# EAGLE design ESP (EAGLE 9.3.0)
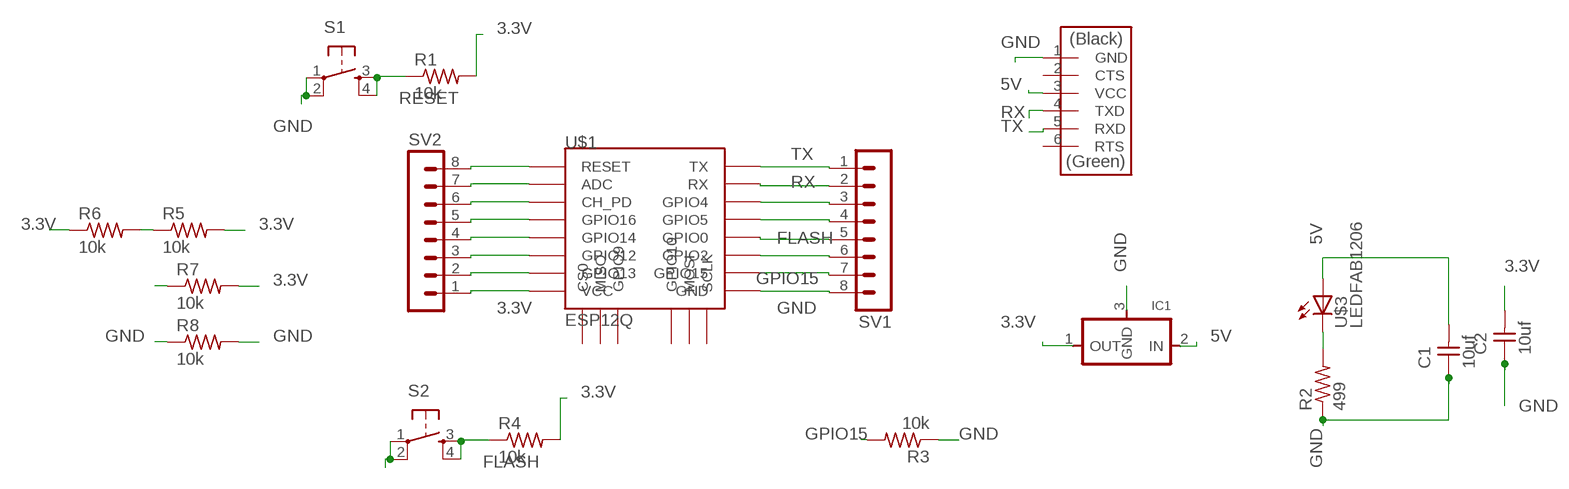
[diagram p0: schematic, sheet 1]

## Parts
C1  10uf  CAP-UNPOLARIZEDFAB  [C1206FAB]
C2  10uf  CAP-UNPOLARIZEDFAB  [C1206FAB]
IC1  REGULATORSOT23  [SOT23]
R1  10k  RES-US1206FAB  [R1206FAB]
R2  499  RES-US1206FAB  [R1206FAB]
R3  10k  RES-US1206FAB  [R1206FAB]
R4  10k  RES-US1206FAB  [R1206FAB]
R5  10k  RES-US1206FAB  [R1206FAB]
R6  10k  RES-US1206FAB  [R1206FAB]
R7  10k  RES-US1206FAB  [R1206FAB]
R8  10k  RES-US1206FAB  [R1206FAB]
S1  6MM_SWITCH6MM_SWITCH  [6MM_SWITCH]
S2  6MM_SWITCH6MM_SWITCH  [6MM_SWITCH]
SV1  MA08-1  [MA08-1]
SV2  MA08-1  [MA08-1]
U$1  ESP12Q  [ESP12Q]
U$2  FTDI-SMD-HEADER  [1X06SMD]
U$3  LEDFAB1206  [LED1206FAB]

## Nets
3.3V: C2.2 IC1.1(OUT) R1.2 R4.2 R5.1 R5.2 R6.1 R6.2 R7.1 R7.2 SV2.1 U$1.VCC
5V: C1.2 IC1.2(IN) U$2.3(VCC) U$3.1(A)
FLASH: R4.1 S2.3(S) S2.4(S1) SV1.5 U$1.GPIO0
GND: C1.1 C2.1 IC1.3(GND) R2.1 R3.1 R8.1 R8.2 S1.1(P) S1.2(P1) SV1.8 U$1.GND U$2.1(GND)
GND1: S2.1(P) S2.2(P1)
GPIO15: R3.2 SV1.7 U$1.GPIO15
N$2: SV2.2 U$1.GPIO13
N$3: SV2.3 U$1.GPIO12
N$4: SV2.4 U$1.GPIO14
N$5: SV2.5 U$1.GPIO16
N$6: SV2.6 U$1.CH_PD
N$7: SV2.7 U$1.ADC
N$9: R2.2 U$3.2(C)
N$11: SV1.3 U$1.GPIO4
N$12: SV1.4 U$1.GPIO5
N$14: SV1.6 U$1.GPIO2
RESET: R1.1 S1.3(S) S1.4(S1) SV2.8 U$1.RESET
RX: SV1.2 U$1.RX U$2.4(TXD)
TX: SV1.1 U$1.TX U$2.5(RXD)
Unconnected: U$1.CS0 U$1.GPIO9 U$1.GPIO10 U$1.MISO U$1.MOSI U$1.SCLK U$2.2(CTS) U$2.6(RTS)

## Library data of the parts
C1 C2 = fab:CAP-UNPOLARIZED
IC1 = fab:REGULATOR
R1-R8 = fab:RES-US: Resistor (US Symbol) Variants with postfix FAB are widened to allow the routing of internal traces
S1 S2 = fab:6MM_SWITCH: OMRON SWITCH
SV1 SV2 = con-lstb:MA08-1: PIN HEADER; OC_FARNELL: unknown; OC_NEWARK: unknown
U$1 = esp826612q:ESP12Q: ESP8266 Wifi module 12-Q
U$2 = fab:FTDI-SMD-HEADER
U$3 = fab:LED: LED

## Board
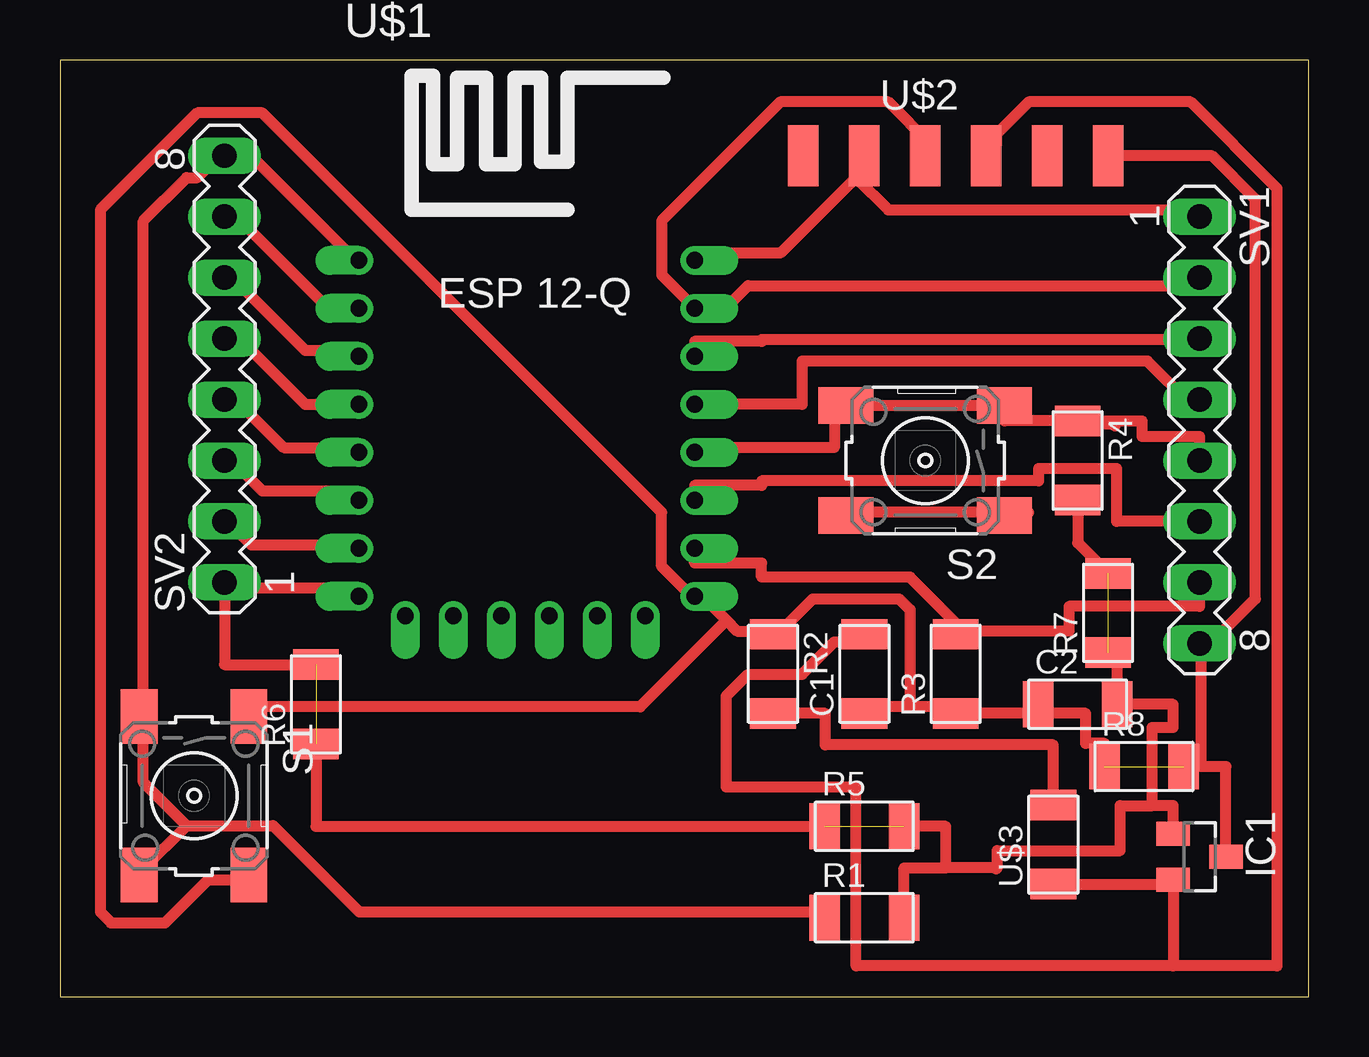
[diagram p1: board, top side]
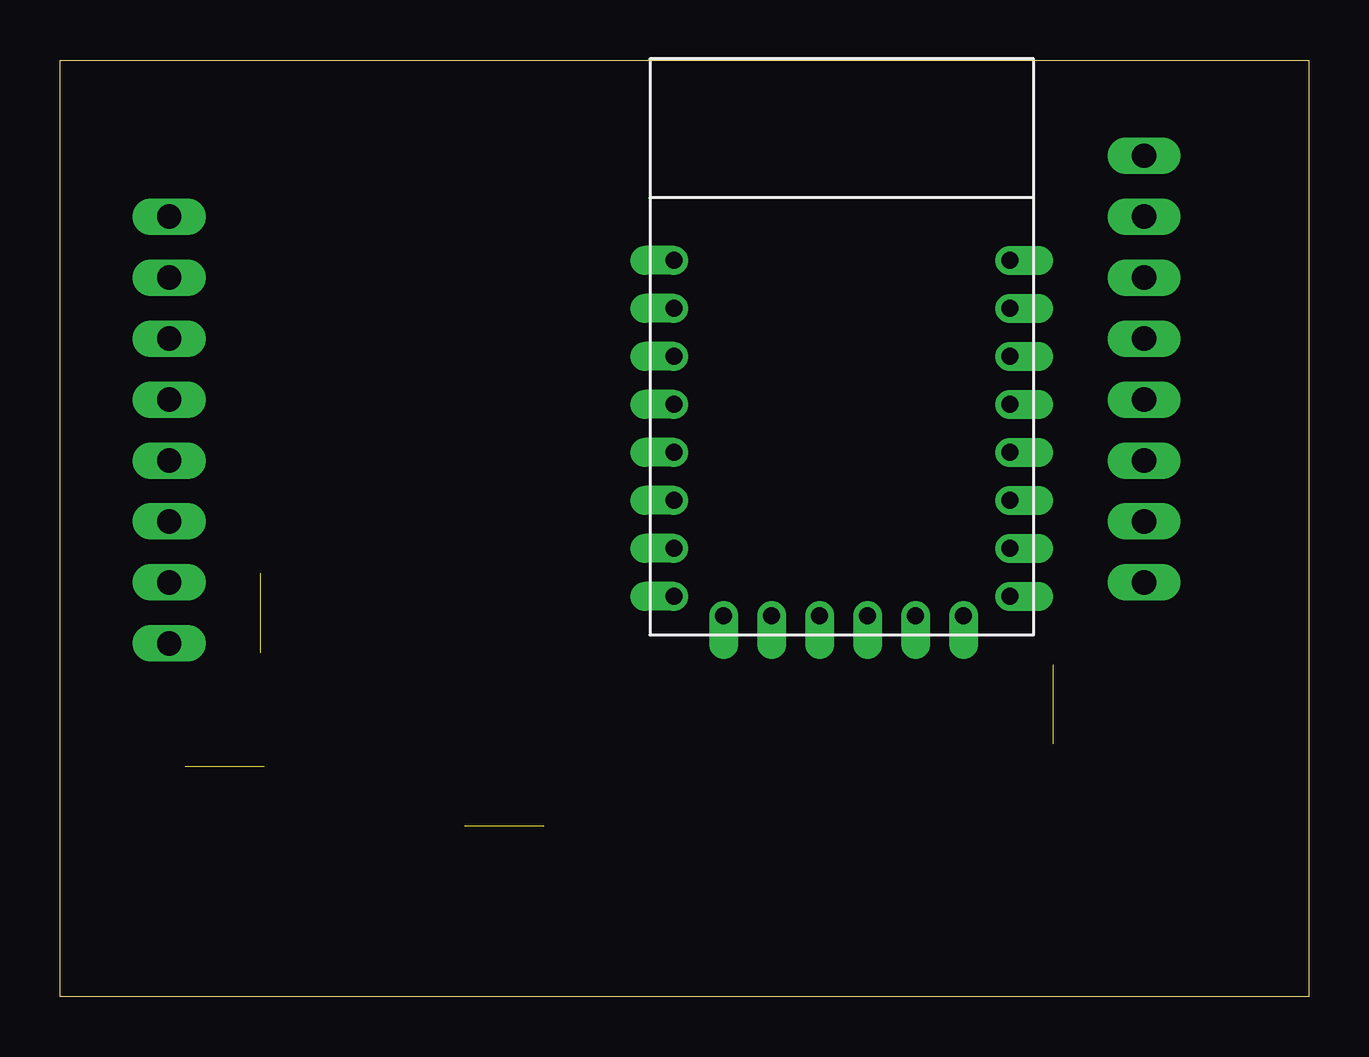
[diagram p2: board, bottom side, seen from below]

Size 52.05 x 39.04 mm. Coordinates in mm from the lower left corner, seen from the top.
Outline: 0,0 52.05,0 52.05,39.04 0,39.04 0,0
Copper layers (1*16): Top 0.035mm / dielectric 1.5mm / Bottom 0.035mm
Design rules "default *": minimum track width 0.45mm, minimum drill 0.35mm, track to track 0.45mm, track to pad 0.45mm, pad to pad 0.45mm, via to via 0.45mm, smd to smd 0.45mm, copper to edge 40mil, drill to drill 6mil, minimum pad ring 10mil, minimum via ring 8mil, stop-mask expansion 4mil, vias tented up to drill 0mil, thermal gap 10mil

### Footprints (pad centres in the part's own frame; a part is rotated, then mirrored left to right if it is on the bottom)
C1206FAB = smd 1.27 x 1.905: 1 -1.651,0; 2 1.651,0
SOT23 = smd 1 x 1.4: 1 -0.95,-1.1; 2 0.95,-1.1; 3 0,1.1
R1206FAB = smd 1.27 x 1.905: 1 -1.651,0; 2 1.651,0
6MM_SWITCH = smd 2.286 x 1.524: 1 -3.302,2.286; 2 3.302,2.286; 3 -3.302,-2.286; 4 3.302,-2.286
MA08-1 = drill 1.016 long: 1 -8.89,0; 2 -6.35,0; 3 -3.81,0; 4 -1.27,0; 5 1.27,0; 6 3.81,0; 7 6.35,0; 8 8.89,0
ESP12Q = drill 0.7 offset: ADC -7.1,3.8; CH_PD -7.1,1.8; CS0 -5.165,-9.005; GND 6.9,-8.2; GPIO0 6.9,-2.2; GPIO2 6.9,-4.2; GPIO4 6.9,1.8; GPIO5 6.9,-0.2; GPIO9 -1.165,-9.005; GPIO10 0.835,-9.005; GPIO12 -7.1,-4.2; GPIO13 -7.1,-6.2; GPIO14 -7.1,-2.2; GPIO15 6.9,-6.2; GPIO16 -7.1,-0.2; MISO -3.165,-9.005; MOSI 2.835,-9.005; RESET -7.1,5.8; RX 6.9,3.8; SCLK 4.835,-9.005; TX 6.9,5.8; VCC -7.1,-8.2
1X06SMD = smd 2.54 x 1.27: 1 0,6.35; 2 0,3.81; 3 0,1.27; 4 0,-1.27; 5 0,-3.81; 6 0,-6.35
LED1206FAB = smd 1.27 x 1.905: 1 -1.651,0; 2 1.651,0

### Placement (x,y rotation side)
C1  33.53,13.46 90 top
C2  42.42,12.19 0 top
IC1  47.5,5.84 270 top
R1  33.53,3.3 0 top
R2  29.72,13.46 270 top
R3  37.34,13.46 90 top
R4  42.42,22.35 270 top
R5  33.53,7.11 0 top
R6  10.67,12.19 90 top
R7  43.69,16 90 top
R8  45.19,9.6 0 top
S1  5.59,8.38 270 top
S2  36.07,22.35 180 top
SV1  47.5,23.62 270 top
SV2  6.86,26.16 90 top
U$1  19.56,24.89 0 top
U$2  37.34,35.05 270 top
U$3  41.4,6.35 90 top

### Tracks (layer width: path | path; a pad name or v marks a point on that pad's centre or on a via)
3.3V  (3 unrouted)
  Top 0.45: U$1.VCC 12.03,17.04 7.08,17.04 SV2.1 6.86,13.84 R6.2 | 46.52,6.85 IC1.1 46.4,7.97 45.53,7.97 | C2.2 43.98,12.17 43.86,12.17 | 39.07,5.38 39.03,5.34 | 35.18,7.47 R5.2 36.92,7.11 36.92,5.38 | 39.07,5.38 36.92,5.38 | R1.2 35.18,5.38 36.92,5.38 | R6.1 10.67,7.11 R5.1 | C2.2 44.07,14.35 R7.1 | R4.2 42.42,18.92 R7.2 | C2.2 46.4,12.19 46.4,11.23 45.53,11.23 45.53,7.97 | 39.07,5.38 39.07,6.1 44.2,6.1 44.2,7.97 45.53,7.97
5V
  Top 0.45: 46.07,4.6 IC1.2 | C1.2 33.18,14.79 32.28,14.79 30.93,13.44 28.68,13.44 27.78,12.54 27.78,8.74 33.19,8.74 33.19,1.29 46.4,1.29 | U$2.3 39.03,35.49 39.03,35.94 40.38,37.29 47.13,37.29 50.73,33.69 50.73,1.29 46.4,1.29 | 46.52,4.6 IC1.2 | IC1.2 46.4,1.29 | U$3.1 46.4,4.7 IC1.2
FLASH
  Top 0.45: 42.26,24.24 R4.1 | 32.81,24.69 S2.4 | 39.11,24.69 S2.3 | U$1.GPIO0 26.88,22.89 32.28,22.89 32.28,24.64 S2.4 | 33.63,24.24 33.15,24.24 S2.4 | 43.98,23.79 43.87,23.87 42.6,23.87 R4.1 | R4.1 45.1,24 45.1,23.35 47.5,23.35 SV1.5 | R4.1 39.37,24 S2.3 | S2.3 S2.4
GND  (1 unrouted)
  Top 0.45: 35.43,12.09 37.23,12.09 R3.1 | 35.43,12.09 33.63,12.09 C1.1 | 40.38,12.17 C2.1 | 37.68,12.09 R3.1 | 48.77,5.95 IC1.3 48.6,9.6 47.58,9.6 | 47.58,14.34 49.83,16.59 49.83,33.24 48.03,35.04 43.98,35.04 U$2.1 | 40.83,12.62 C2.1 | 27.78,15.69 26.88,16.59 U$1.GND 26.43,16.59 25.08,17.94 25.08,20.19 8.43,36.84 5.73,36.84 1.68,32.79 1.68,3.54 2.13,3.09 4.38,3.09 6.18,4.89 7.53,4.89 S1.2 | 27.78,15.69 28.23,15.24 29.58,15.24 R2.1 30.03,15.24 31.38,16.59 34.98,16.59 35.43,16.14 35.43,12.09 | 27.78,15.69 24.18,12.09 7.98,12.09 S1.1 | C2.1 40.77,11.81 | 40.77,11.81 R3.1 | 47.58,9.6 R8.2 | 47.58,9.6 47.58,14.34 | R8.1 43.54,10.56 42.76,10.56 42.76,11.81 40.77,11.81 | SV1.8 47.5,14.34 47.58,14.34
GND1
  Top 0.45: 40.38,20.19 32.81,20.19 S2.2 | 39.11,20.19 S2.1
GPIO15
  Top 0.45: 37.68,15.24 35.43,17.49 29.25,17.49 29.25,18.07 26.46,18.07 U$1.GPIO15 | 37.68,15.24 R3.2 | SV1.7 47.5,16.27 42.06,16.27 42.06,15.24 37.68,15.24
N$2
  Top 0.45: U$1.GPIO13 12.03,18.84 7.98,18.84 7.08,19.74 SV2.2
N$3
  Top 0.45: U$1.GPIO12 12.03,21.09 8.43,21.09 7.08,22.44 SV2.3
N$4
  Top 0.45: U$1.GPIO14 12.03,22.89 9.33,22.89 7.08,25.14 SV2.4
N$5
  Top 0.45: U$1.GPIO16 10.23,24.69 7.08,27.84 SV2.5
N$6
  Top 0.45: U$1.CH_PD 12.03,26.94 10.23,26.94 7.08,30.09 SV2.6
N$7
  Top 0.45: U$1.ADC 12.03,28.74 11.13,28.74 7.08,32.79 SV2.7
N$9
  Top 0.45: R2.2 31.9,11.81 31.9,10.5 41.4,10.5 U$3.2
N$11
  Top 0.45: SV1.3 47.13,27.39 29.25,27.39 29.25,27.31 26.46,27.31 U$1.GPIO4
N$12
  Top 0.45: U$1.GPIO5 30.93,24.69 30.93,26.49 45.33,26.49 47.13,24.69 SV1.4
N$14
  Top 0.45: SV1.6 44.05,19.81 44.05,22.01 40.79,22.01 40.79,21.5 29.25,21.5 29.25,21.31 26.46,21.31 U$1.GPIO2
RESET
  Top 0.45: U$1.RESET 12.03,30.99 7.98,35.04 7.08,35.04 SV2.8 6.63,35.04 5.73,34.14 5.28,34.14 3.48,32.34 3.48,12.09 S1.3 3.48,11.64 3.48,8.94 5.28,7.14 | 5.28,7.14 8.88,7.14 12.48,3.54 31.62,3.54 R1.1 | 5.28,7.14 3.48,5.34 S1.4
RX
  Top 0.45: U$2.4 36.33,35.49 34.53,37.29 30.03,37.29 25.08,32.34 25.08,30.09 26.43,28.74 U$1.RX 26.88,28.74 27.78,28.74 28.68,29.64 47.13,29.64 SV1.2
TX
  Top 0.45: 33.18,34.14 30.03,30.99 26.88,30.99 U$1.TX | 33.18,34.14 33.18,35.04 U$2.5 33.18,34.14 | 33.18,34.14 34.53,32.79 47.13,32.79 SV1.1